# Altium project BA16_mema_1 (2).PrjPcb
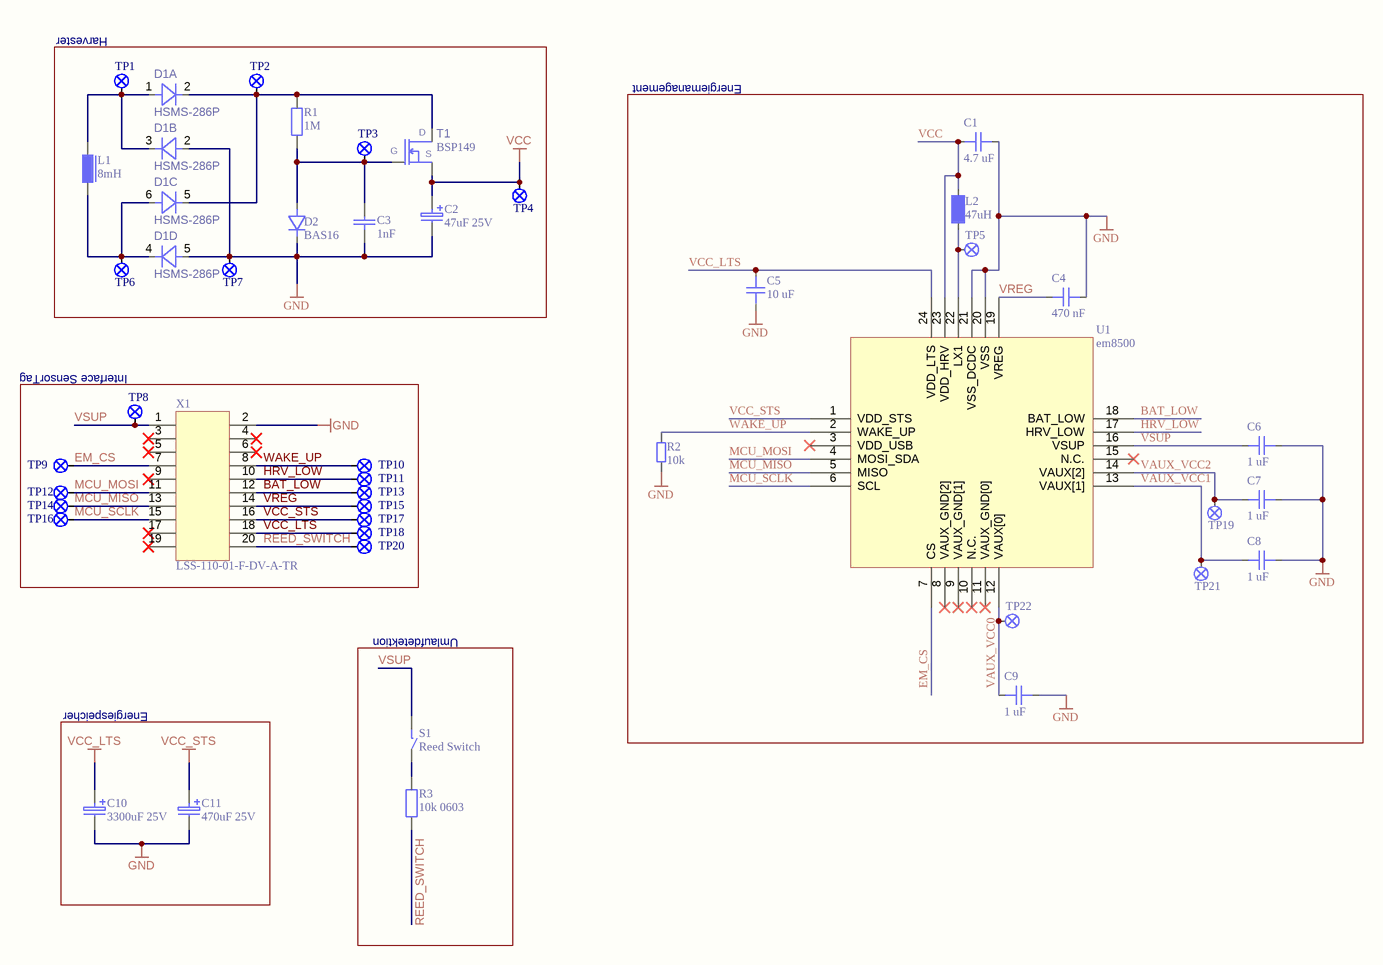
[diagram p0: Harvester.SchDoc]
1 sheet, 44 parts. Net scope: global (net labels, ports and power ports of the same name join across sheets).
Board file: BA16_mema_1_layout.PcbDoc

## Sheet Harvester.SchDoc
size A3

### Parts
C1  value 4.7 uF  [CHIP 1206]  (hidden comment: Cap)
C2  47uF 25V  [ELKO SMD-C 6.3x6.3]
C3  1nF  [CHIP 0603]
C4  value 470 nF  [CHIP 0603]  (hidden comment: Cap)
C5  value 10 uF  [CHIP 1206]  (hidden comment: Cap)
C6  value 1 uF  [CHIP 0603]  (hidden comment: Cap)
C7  value 1 uF  [CHIP 0603]  (hidden comment: Cap)
C8  value 1 uF  [CHIP 0603]  (hidden comment: Cap)
C9  value 1 uF  [CHIP 0603]  (hidden comment: Cap)
C10  3300uF 25V  [C_RAD_flex]
C11  470uF 25V  [C_RAD_flex]
D1  HSMS-286P  [SOT-363 (SC-70)]  (parts A,B,C,D of 4)
D2  BAS16  [SOT-23]
L1  8mH  [WE_74458308]
L2  value 47uH  [CHIP 0805]  (hidden comment: L)
R1  1M  [CHIP 0603]
R2  value 10k  [CHIP 0603]  (hidden comment: R)
R3  10k 0603  [CHIP 0603]
S1  Reed Switch  [MK16-C-2]
T1  BSP149  [SOT-223]
TP1  TP_SMD  [TP SMD]  (value not drawn)  (no BOM)
TP2  TP_SMD  [TP SMD]  (value not drawn)  (no BOM)
TP3  TP_SMD  [TP SMD]  (value not drawn)  (no BOM)
TP4  TP_SMD  [TP SMD]  (value not drawn)  (no BOM)
TP5  TP_SMD  [TP SMD]  (value not drawn)  (no BOM)
TP6  TP_SMD  [TP SMD]  (value not drawn)  (no BOM)
TP7  TP_SMD  [TP SMD]  (value not drawn)  (no BOM)
TP8  TP_SMD  [TP SMD]  (value not drawn)  (no BOM)
TP9  TP_SMD  [TP SMD]  (value not drawn)  (no BOM)
TP10  TP_SMD  [TP SMD]  (value not drawn)  (no BOM)
TP11  TP_SMD  [TP SMD]  (value not drawn)  (no BOM)
TP12  TP_SMD  [TP SMD]  (value not drawn)  (no BOM)
TP13  TP_SMD  [TP SMD]  (value not drawn)  (no BOM)
TP14  TP_SMD  [TP SMD]  (value not drawn)  (no BOM)
TP15  TP_SMD  [TP SMD]  (value not drawn)  (no BOM)
TP16  TP_SMD  [TP SMD]  (value not drawn)  (no BOM)
TP17  TP_SMD  [TP SMD]  (value not drawn)  (no BOM)
TP18  TP_SMD  [TP SMD]  (value not drawn)  (no BOM)
TP19  TP_SMD  [TP SMD]  (value not drawn)  (no BOM)
TP20  TP_SMD  [TP SMD]  (value not drawn)  (no BOM)
TP21  TP_SMD  [TP SMD]  (value not drawn)  (no BOM)
TP22  TP_SMD  [TP SMD]  (value not drawn)  (no BOM)
U1  em8500  [QFN-24]
X1  LSS-110-01-F-DV-A-TR  [HEADER SMD 2x10 0.635mm]

### Blocks framed on the sheet
Harvester: C2 C3 D1 D2 L1 R1 T1 TP1-TP4 TP6 TP7
Energiemanagement: C1 C4-C9 L2 R2 TP5 TP19 TP21 TP22 U1
Interface SensorTag: TP8-TP18 TP20 X1
Umlaufdetektion: R3 S1
Energiespeicher: C10 C11

### Nets
GND: C1.2 C2.2(NEG) C3.1 C4.2 C5.2 C6.2 C7.2 C8.2 C9.2 C10.2(NEG) C11.2(NEG) D1.2(A) D1.5(A) D2.2(K) R2.2 TP7.1 U1.20(VSS) U1.21(VSS_DCDC) X1.2
VCC: C1.1 C2.1(POS) L2.2 T1.2(S) TP4.1 U1.23(VDD_HRV)
VCC_LTS: C5.1 C10.1(POS) TP18.1 U1.24(VDD_LTS) X1.18
VCC_STS: C11.1(POS) TP17.1 U1.1(VDD_STS) X1.16
BAT_LOW: TP13.1 U1.18(BAT_LOW) X1.12
EM_CS: TP9.1 U1.7(CS) X1.7
HRV_LOW: TP11.1 U1.17(HRV_LOW) X1.10
MCU_MISO: TP14.1 U1.5(MISO) X1.13
MCU_MOSI: TP12.1 U1.4(MOSI_SDA) X1.11
MCU_SCLK: TP16.1 U1.6(SCL) X1.15
REED_SWITCH: R3.1 TP20.1 X1.20
VAUX_VCC0: C9.1 TP22.1 U1.12(VAUX[0])
VAUX_VCC1: C8.1 TP21.1 U1.13(VAUX[1])
VAUX_VCC2: C7.1 TP19.1 U1.14(VAUX[2])
VREG: C4.1 TP15.1 U1.19(VREG) X1.14
VSUP: C6.1 S1.2 TP8.1 U1.16(VSUP) X1.1
WAKE_UP: R2.1 TP10.1 U1.2(WAKE_UP) X1.8
NetC3_2: C3.2 D2.1(A) R1.1 T1.1(G) TP3.1
NetD1_1: D1.1(A) D1.3(K) L1.2 TP1.1
NetD1_2: D1.2(K) D1.5(K) R1.2 T1.3(D) TP2.1
NetD1_4: D1.4(K) D1.6(A) L1.1 TP6.1
NetL2_1: L2.1 TP5.1 U1.22(LX1)
NetR3_2: R3.2 S1.1

Not connected (* = marked no-connect by the designer): U1 3(VDD_USB)* 8(VAUX_GND[2])* 9(VAUX_GND[1])* 10(N.C.)* 11(VAUX_GND[0])* 15(N.C.)*; X1 3* 4* 5* 6* 9* 17* 19*

### Notes on the sheet
- Rev
- Date
- Sign
- Release Notes
- Title
- © IMS
- This document is property of IMS - Institute of Mechatronic Systems
- No copying or distribution without prior written permission of IMS
- Sheet
- Size
- A3
- Document Number
- of
- Print date:
- Drawn by:
- Revision
- File:

### Library data of the parts
C1 = C: Capacitor; Manufacturer Part Number: GRM31CR71E475KA88L; Manufacturer: Murata; Dist Order No: 1828835RL; Category: Capacitor; Distributor: Farnell
C2 = C POL: Capasitor Polarisiert; Manufacturer: Vishay; Class: 63 Capacitor; Dist Order No: 1187015; Man Order No: MAL215375479E3; Distributor: Farnell; Component: *
C3 = C 50V: Capacitor 50V; Manufacturer: AVX; Class: 63 Capacitor; Dist Order No: 2332585RL; Man Order No: 06033C102KAT2A; Component: *; Distributor: Farnell
C4 = C: Capacitor; Manufacturer Part Number: CGA3E3X7R1E474K080AB; Manufacturer: TDK; Dist Order No: 2210923RL; Category: Capacitor; Distributor: Farnell
C5 = C: Capacitor; Manufacturer Part Number: CGA5L1X7R1E106K160AC; Manufacturer: TDK; Dist Order No: 2211068RL; Category: Capacitor; Distributor: Farnell
C6-C9 = C: Capacitor; Manufacturer Part Number: CGA3E1X7R1E105K080AC; Manufacturer: TDK; Dist Order No: 2346962RL; Category: Capacitor; Distributor: Farnell
C10 = C POL: Capasitor Polarisiert; Manufacturer: Panasonic; Class: 63 Capacitor; Dist Order No: 2313351; Man Order No: EEUFR1E332B; Note: RM 2.5mm/5mm/7.5mm/10mm; Distributor: Farnell; Component: *
C11 = C POL: Capasitor Polarisiert; Manufacturer: Panasonic; Class: 63 Capacitor; Dist Order No: 2313355; Man Order No: EEUFR1E471B; Distributor: Farnell; Component: *
D1 = HSMS-286P: Diode Schottky Quadro; Class: 11 Diode; Component: *; Distributor: *; Dist Order No: *; Manufacturer: *; Man Order No: *
D2 = D: Diode; Manufacturer: ON SEMICONDUCTOR; Class: 11 Diode; Dist Order No: 9558659RL; Man Order No: BAS16LT1G; Component: *; Distributor: Farnell
L1 = L: Inductor; Manufacturer: Würth Elektronik; Class: 65 Indctor; Dist Order No: 1961683RL; Man Order No: 74458308; Component: *; Distributor: Farnell
L2 = L: Ind; Manufacturer Part Number: 0805PS-473KLB; Manufacturer: Coilcraft; Dist Order No: 2286575RL; Category: Inductor; Distributor: Farnell
R1 = R: Resistor; Manufacturer: Vishay; Class: 61 Resistor; Dist Order No: 1469746RL; Man Order No: CRCW06031M00FKEA; Component: *; Distributor: Farnell
R2 = R: Resistor; Manufacturer Part Number: CRCW06031K00FKEA; Manufacturer: Vishay; Dist Order No: 1469740RL; Category: Resistor; Distributor: Farnell
R3 = R: Resistor; Manufacturer: Vishay; Class: 61 Resistor; Dist Order No: 1469740RL; Man Order No: CRCW06031K00FKEA; Component: *; Distributor: Farnell; Value: 10k
S1 = SWITCH MICRO NO: Switch Micro Normal Open; Manufacturer: STANDEXMEDER; Class: 81 Switch; Dist Order No: 1079488; Component: Reed Switch; Distributor: Farnell; Man Order No: MK16-C-2
T1 = BSP149: MOSFET N-Kanal; Manufacturer: Infineon; Class: 22 FET; Dist Order No: 2480627RL; Man Order No: BSP149 H6906; Component: *; Distributor: Farnell
TP1-TP22 = TP_SMD: Testpoint SMD
U1 = em8500: Manufacturer: EM Microelectronic; Manufacturer Part Number: EM8500
X1 = HDR 20 POL ABW: Header 100 mil 20 Pol; Manufacturer: Samtech; Class: 73 Connector 100 mil; Dist Order No: 2504990; Component: *; Distributor: Farnell; Man Order No: LSS-110-01-F-DV-A-TR